# Altium schematic sheet MagnetismLock.SchDoc
size A4
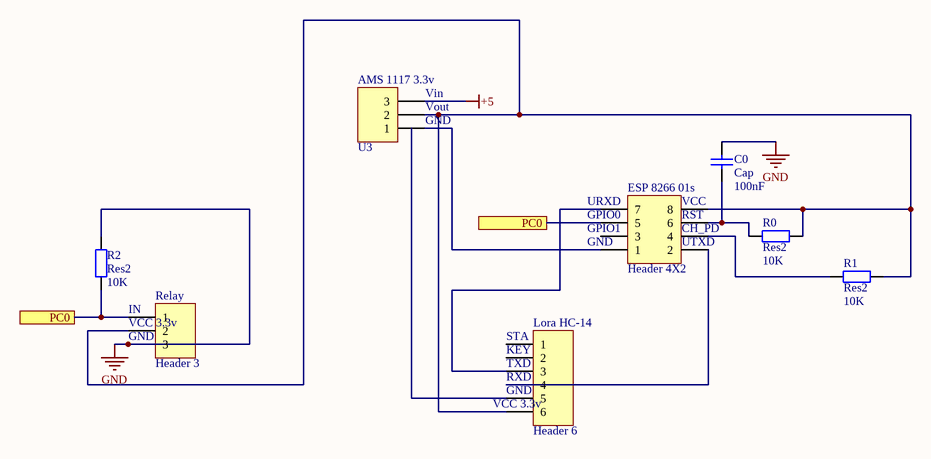
[diagram p0: MagnetismLock.SchDoc]

## Parts
AMS_1117_3.3v  U3  [HDR1X3]
C0  Cap  value 100nF  [RAD-0.3]
ESP_8266_01s  Header 4X2  [HDR2X4]
Lora_HC-14  Header 6  [HDR1X6]
R0  Res2  value 10K  [AXIAL-0.4]
R1  Res2  value 10K  [AXIAL-0.4]
R2  Res2  value 10K  [AXIAL-0.4]
Relay  Header 3  [HDR1X3]

## Ports
PC0

## Nets
+5: AMS_1117_3.3v.3
GND: C0.2 R2.1 Relay.3
PC0: ESP_8266_01s.5 R2.2 Relay.1 ; port PC0
NetAMS_1117_3.3v_1: AMS_1117_3.3v.1 ESP_8266_01s.1
NetAMS_1117_3.3v_2: AMS_1117_3.3v.2 ESP_8266_01s.8 Lora_HC-14.6 R0.1 R1.1 Relay.2
NetC0_1: C0.1 ESP_8266_01s.6 R0.2
NetESP_8266_01s_2: ESP_8266_01s.2 Lora_HC-14.4
NetESP_8266_01s_4: ESP_8266_01s.4 R1.2
NetESP_8266_01s_7: ESP_8266_01s.7 Lora_HC-14.3

Not connected (* = marked no-connect by the designer): ESP_8266_01s 3; Lora_HC-14 1 2 5

## Notes on the sheet
- (near AMS_1117_3.3v) Vout
- (near AMS_1117_3.3v) Vin
- (near AMS_1117_3.3v) GND
- (near ESP_8266_01s) GND
- (near ESP_8266_01s) GPIO1
- (near ESP_8266_01s) GPIO0
- (near ESP_8266_01s) URXD
- (near ESP_8266_01s) UTXD
- (near ESP_8266_01s) CH_PD
- (near ESP_8266_01s) RST
- (near ESP_8266_01s) VCC
- (near Relay) IN
- (near Relay) GND
- (near Relay) VCC 3.3v
- (near Lora_HC-14) STA
- (near Lora_HC-14) KEY
- (near Lora_HC-14) TXD
- (near Lora_HC-14) RXD
- (near Lora_HC-14) VCC 3.3v
- (near Lora_HC-14) GND

## Library data of the parts
AMS_1117_3.3v Relay = Header 3: Header, 3-Pin; LatestRevisionDate: 17-Jul-2002; LatestRevisionNote: Re-released for DXP Platform.; Publisher: Altium Limited
C0 = Cap: Capacitor; Published: 8-Jun-2000; LatestRevisionDate: 17-Jul-2002; LatestRevisionNote: Re-released for DXP Platform.; PackageReference: RAD-0.3; Publisher: Altium Limited; PackageDescription: Radial Cap, Thru-Hole; 2 Leads; 0.3 in Pin Spacing
ESP_8266_01s = Header 4X2: Header, 4-Pin, Dual row; LatestRevisionDate: 17-Jul-2002; LatestRevisionNote: Re-released for DXP Platform.; Publisher: Altium Limited
Lora_HC-14 = Header 6: Header, 6-Pin; LatestRevisionDate: 17-Jul-2002; LatestRevisionNote: Re-released for DXP Platform.; Publisher: Altium Limited
R0-R2 = Res2: Resistor; Published: 8-Jun-2000; LatestRevisionDate: 17-Jul-2002; LatestRevisionNote: Re-released for DXP Platform.; PackageReference: AXIAL-0.4; Publisher: Altium Limited; PackageDescription: Axial Device, Thru-Hole; 2 Leads; 0.4 in Pin Spacing